# EAGLE design Easy_Check_rev2_chip_tray (EAGLE 9.4.0)
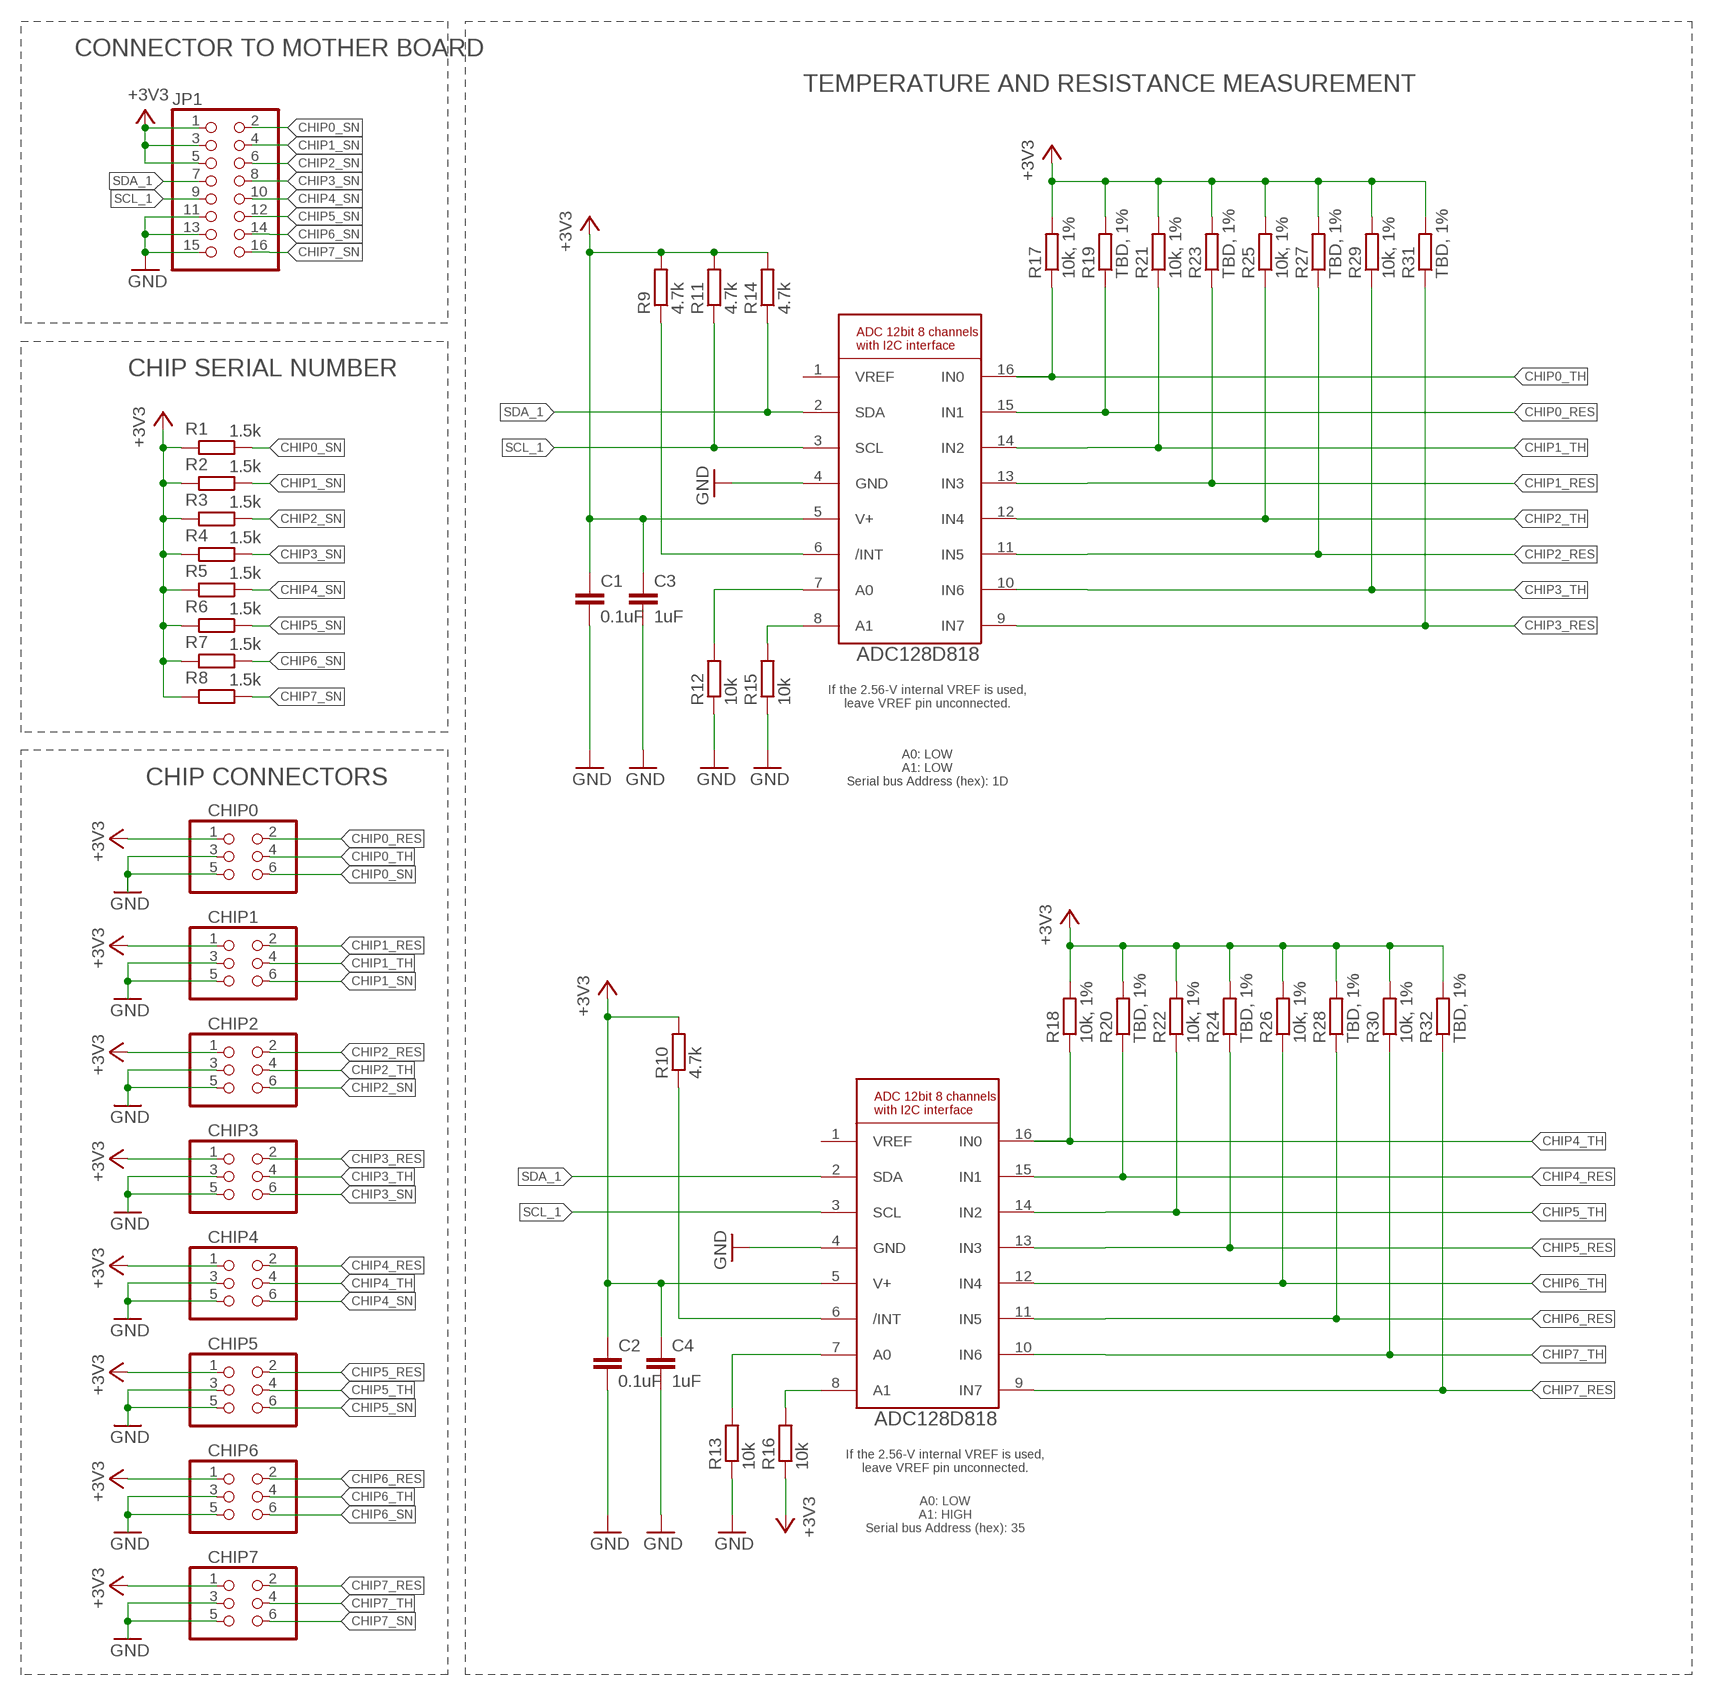
[diagram p0: schematic, sheet 1]

## Parts
C1  0.1uF  C-EUC0603  [C0603]
C2  0.1uF  C-EUC0603  [C0603]
C3  1uF  C-EUC0603  [C0603]
C4  1uF  C-EUC0603  [C0603]
CHIP0  PINHD-2X3  [2X03]
CHIP1  PINHD-2X3  [2X03]
CHIP2  PINHD-2X3  [2X03]
CHIP3  PINHD-2X3  [2X03]
CHIP4  PINHD-2X3  [2X03]
CHIP5  PINHD-2X3  [2X03]
CHIP6  PINHD-2X3  [2X03]
CHIP7  PINHD-2X3  [2X03]
JP1  PINHD-2X8  [2X08]
R1  1.5k  R-EU_R0603  [R0603]
R2  1.5k  R-EU_R0603  [R0603]
R3  1.5k  R-EU_R0603  [R0603]
R4  1.5k  R-EU_R0603  [R0603]
R5  1.5k  R-EU_R0603  [R0603]
R6  1.5k  R-EU_R0603  [R0603]
R7  1.5k  R-EU_R0603  [R0603]
R8  1.5k  R-EU_R0603  [R0603]
R9  4.7k  R-EU_R0603  [R0603]
R10  4.7k  R-EU_R0603  [R0603]
R11  4.7k  R-EU_R0603  [R0603]
R12  10k  R-EU_R0603  [R0603]
R13  10k  R-EU_R0603  [R0603]
R14  4.7k  R-EU_R0603  [R0603]
R15  10k  R-EU_R0603  [R0603]
R16  10k  R-EU_R0603  [R0603]
R17  10k, 1%  R-EU_R0603  [R0603]
R18  10k, 1%  R-EU_R0603  [R0603]
R19  TBD, 1%  R-EU_R0603  [R0603]
R20  TBD, 1%  R-EU_R0603  [R0603]
R21  10k, 1%  R-EU_R0603  [R0603]
R22  10k, 1%  R-EU_R0603  [R0603]
R23  TBD, 1%  R-EU_R0603  [R0603]
R24  TBD, 1%  R-EU_R0603  [R0603]
R25  10k, 1%  R-EU_R0603  [R0603]
R26  10k, 1%  R-EU_R0603  [R0603]
R27  TBD, 1%  R-EU_R0603  [R0603]
R28  TBD, 1%  R-EU_R0603  [R0603]
R29  10k, 1%  R-EU_R0603  [R0603]
R30  10k, 1%  R-EU_R0603  [R0603]
R31  TBD, 1%  R-EU_R0603  [R0603]
R32  TBD, 1%  R-EU_R0603  [R0603]
U1  LMD128D818  [ADC128D818]
U2  LMD128D818  [ADC128D818]

## Nets
+3V3: C1.1 C2.1 C3.1 C4.1 CHIP0.1 CHIP1.1 CHIP2.1 CHIP3.1 CHIP4.1 CHIP5.1 CHIP6.1 CHIP7.1 JP1.1 JP1.3 JP1.5 R1.2 R2.2 R3.2 R4.2 R5.2 R6.2 R7.2 R8.2 R9.2 R10.2 R11.2 R14.2 R16.1 R17.2 R18.2 R19.2 R20.2 R21.2 R22.2 R23.2 R24.2 R25.2 R26.2 R27.2 R28.2 R29.2 R30.2 R31.2 R32.2 U1.5(V+) U2.5(V+)
CHIP0_RES: CHIP0.2 R19.1 U1.15(IN1)
CHIP0_SN: CHIP0.6 JP1.2 R1.1
CHIP0_TH: CHIP0.4 R17.1 U1.16(IN0)
CHIP1_RES: CHIP1.2 R23.1 U1.13(IN3)
CHIP1_SN: CHIP1.6 JP1.4 R2.1
CHIP1_TH: CHIP1.4 R21.1 U1.14(IN2)
CHIP2_RES: CHIP2.2 R27.1 U1.11(IN5)
CHIP2_SN: CHIP2.6 JP1.6 R3.1
CHIP2_TH: CHIP2.4 R25.1 U1.12(IN4)
CHIP3_RES: CHIP3.2 R31.1 U1.9(IN7)
CHIP3_SN: CHIP3.6 JP1.8 R4.1
CHIP3_TH: CHIP3.4 R29.1 U1.10(IN6)
CHIP4_RES: CHIP4.2 R20.1 U2.15(IN1)
CHIP4_SN: CHIP4.6 JP1.10 R5.1
CHIP4_TH: CHIP4.4 R18.1 U2.16(IN0)
CHIP5_RES: CHIP5.2 R24.1 U2.13(IN3)
CHIP5_SN: CHIP5.6 JP1.12 R6.1
CHIP5_TH: CHIP5.4 R22.1 U2.14(IN2)
CHIP6_RES: CHIP6.2 R28.1 U2.11(IN5)
CHIP6_SN: CHIP6.6 JP1.14 R7.1
CHIP6_TH: CHIP6.4 R26.1 U2.12(IN4)
CHIP7_RES: CHIP7.2 R32.1 U2.9(IN7)
CHIP7_SN: CHIP7.6 JP1.16 R8.1
CHIP7_TH: CHIP7.4 R30.1 U2.10(IN6)
GND: C1.2 C2.2 C3.2 C4.2 CHIP0.3 CHIP0.5 CHIP1.3 CHIP1.5 CHIP2.3 CHIP2.5 CHIP3.3 CHIP3.5 CHIP4.3 CHIP4.5 CHIP5.3 CHIP5.5 CHIP6.3 CHIP6.5 CHIP7.3 CHIP7.5 JP1.11 JP1.13 JP1.15 R12.1 R13.1 R15.1 U1.4(GND) U2.4(GND)
N$1: R9.1 U1.6(/INT)
N$2: R10.1 U2.6(/INT)
N$3: R12.2 U1.7(A0)
N$4: R15.2 U1.8(A1)
N$5: R13.2 U2.7(A0)
N$6: R16.2 U2.8(A1)
SCL_1: JP1.9 R11.1 U1.3(SCL) U2.3(SCL)
SDA_1: JP1.7 R14.1 U1.2(SDA) U2.2(SDA)
Unconnected: U1.1(VREF) U2.1(VREF)

## Notes on the sheet
- CONNECTOR TO MOTHER BOARD
- TEMPERATURE AND RESISTANCE MEASUREMENT
- CHIP SERIAL NUMBER
- If the 2.56-V internal VREF is used,
  leave VREF pin unconnected.
- A0: LOW
  A1: LOW
  Serial bus Address (hex): 1D
- CHIP CONNECTORS
- If the 2.56-V internal VREF is used,
  leave VREF pin unconnected.
- A0: LOW
  A1: HIGH
  Serial bus Address (hex): 35

## Library data of the parts
C1-C4 = rcl:C-EU: CAPACITOR, European symbol; SPICEPREFIX: C
CHIP0 CHIP1-CHIP7 = pinhead:PINHD-2X3: PIN HEADER
JP1 = pinhead:PINHD-2X8: PIN HEADER
R1-R32 = rcl:R-EU_: RESISTOR, European symbol; SPICEPREFIX: R
U1 U2 = ADS128D818:LMD128D818: ADC 12-Bit, 8-Channel, ADC System Monitor with Temperature Sensor, Internal/External Reference, and I2C Interface http://www.ti.com/product/adc128d818 http://fr.farnell.com/texas-instruments/adc128d818cimt-nopb/adc-12-bits-10sps-i2c-tssop-16/dp/2395888

## Board
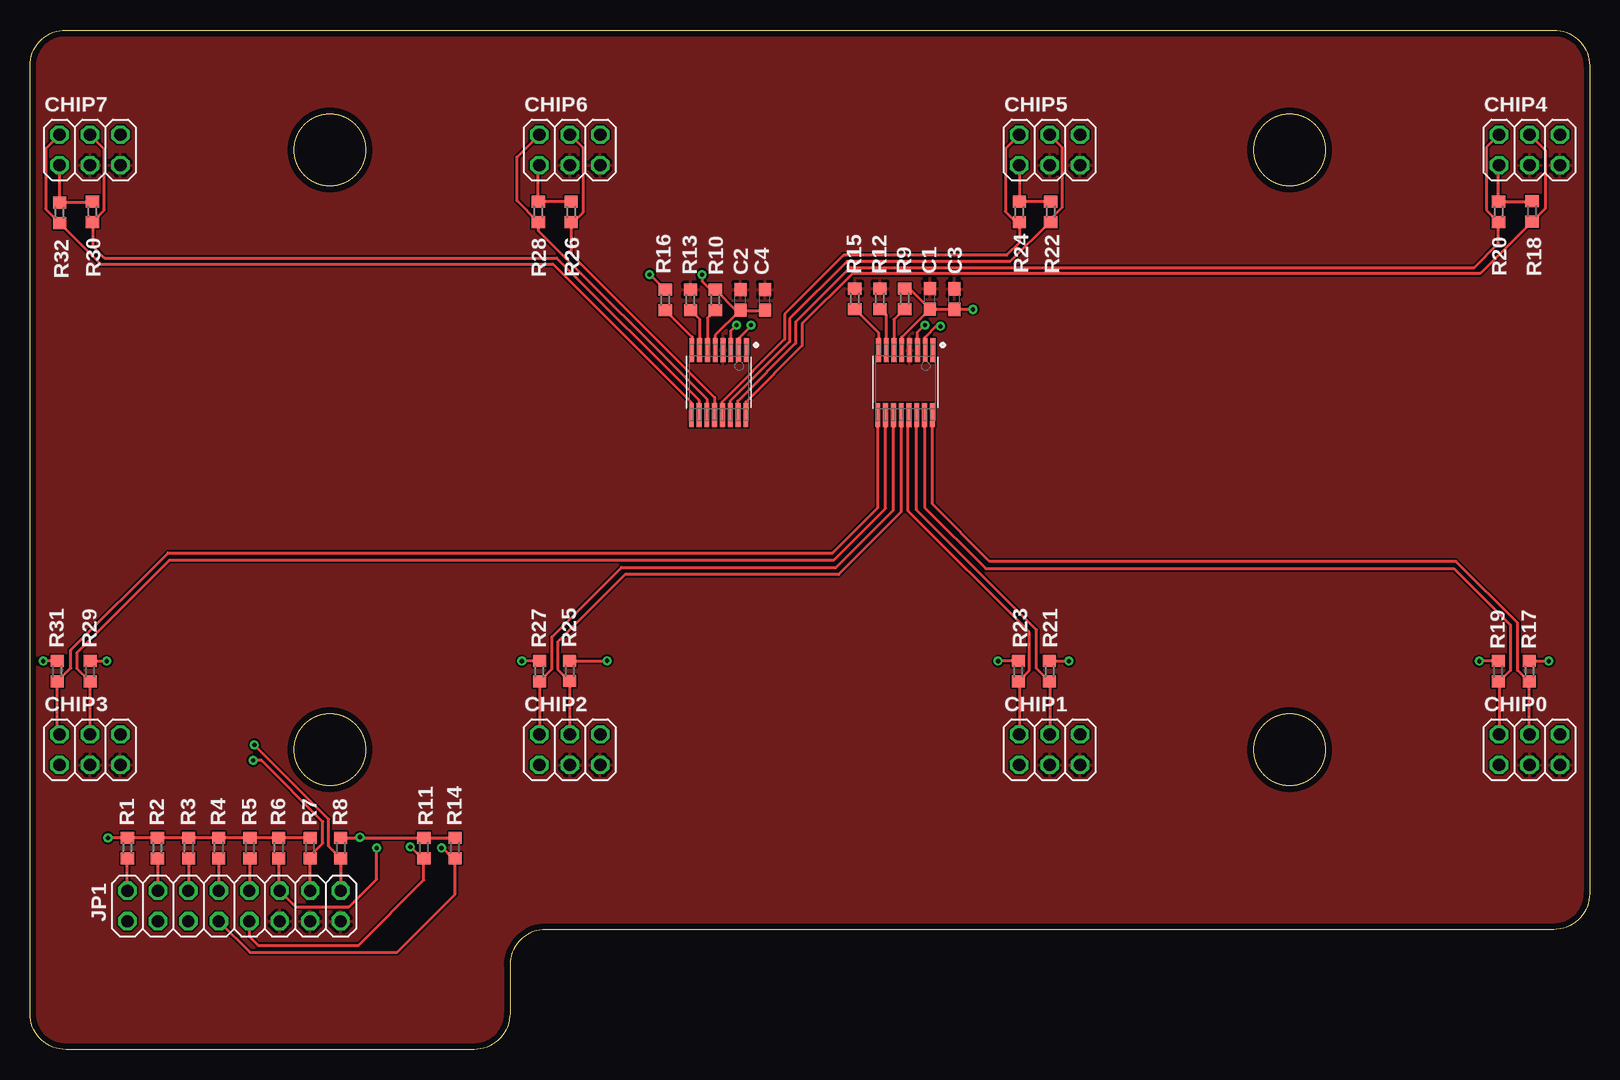
[diagram p1: board, top side]
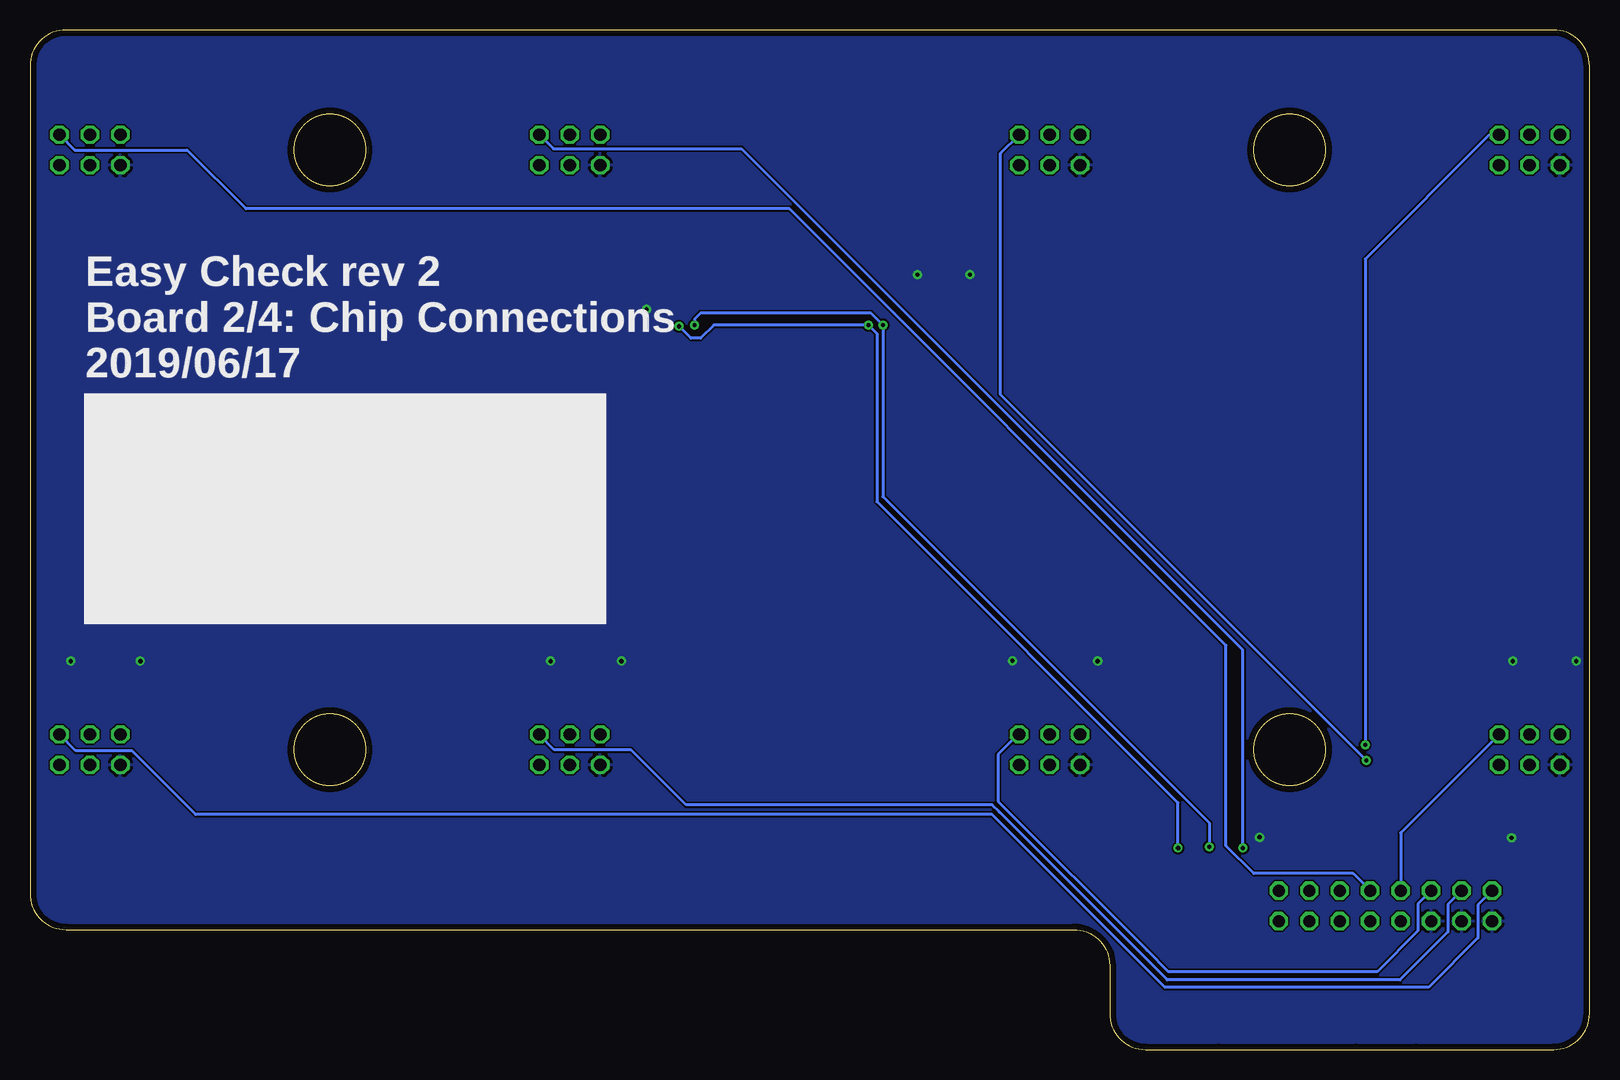
[diagram p2: board, bottom side, seen from below]

Size 130 x 85 mm. Coordinates in mm from the lower left corner, seen from the top.
Outline: 14.45,0 3,0
Outline: 30.9,0 19.45,0
Outline: 0,82 arc-90 3,85
Outline: 3,85 127,85
Outline: 127,85 arc-90 130,82
Outline: 130,82 130,13
Outline: 130,13 arc-90 127,10
Outline: 127,10 43,10
Outline: 43,10 arc90 40,7
Outline: 40,7 40,3
Outline: 40,3 arc-90 37,0
Outline: 37,0 3,0
Outline: 3,0 arc-90 0,3
Outline: 0,3 0,82
Outline: 0,82 arc-90 3,85
Outline: 3,85 127,85
Outline: 127,85 arc-90 130,82
Outline: 130,82 130,13
Outline: 130,13 arc-90 127,10
Outline: 127,10 43,10
Outline: 43,10 arc90 40,7
Outline: 40,7 40,3
Outline: 40,3 arc-90 37,0
Outline: 37,0 3,0
Outline: 3,0 arc-90 0,3
Outline: 0,3 0,82
Outline: circle at 25,25 radius 3
Outline: circle at 25,75 radius 3
Outline: circle at 105,75 radius 3
Outline: circle at 105,25 radius 3
Outline: circle at 25,25 radius 3
Outline: circle at 25,75 radius 3
Outline: circle at 105,75 radius 3
Outline: circle at 105,25 radius 3
Copper layers (1*16): Top 0.035mm / dielectric 1.5mm / Bottom 0.035mm
Design rules "default": minimum track width 6mil, minimum drill 0.35mm, track to track 6mil, track to pad 6mil, pad to pad 6mil, via to via 6mil, smd to smd 6mil, copper to edge 20mil, drill to drill 6mil, minimum pad ring 10mil, minimum via ring 8mil, stop-mask expansion 4mil, vias tented up to drill 0.4mm, thermal gap 10mil

### Footprints (pad centres in the part's own frame; a part is rotated, then mirrored left to right if it is on the bottom)
C0603 = smd 1.1 x 1: 1 -0.85,0; 2 0.85,0
2X03 = drill 1.016 octagon: 1 -2.54,-1.27; 2 -2.54,1.27; 3 0,-1.27; 4 0,1.27; 5 2.54,-1.27; 6 2.54,1.27
2X08 = drill 1.016 octagon: 1 -8.89,-1.27; 2 -8.89,1.27; 3 -6.35,-1.27; 4 -6.35,1.27; 5 -3.81,-1.27; 6 -3.81,1.27; 7 -1.27,-1.27; 8 -1.27,1.27; 9 1.27,-1.27; 10 1.27,1.27; 11 3.81,-1.27; 12 3.81,1.27; 13 6.35,-1.27; 14 6.35,1.27; 15 8.89,-1.27; 16 8.89,1.27
R0603 = smd 1 x 1.1: 1 -0.85,0; 2 0.85,0
ADC128D818 = smd 0.4 x 2: 1 -2.3,-2.7; 2 -1.65,-2.7; 3 -1,-2.7; 4 -0.35,-2.7; 5 0.3,-2.7; 6 0.95,-2.7; 7 1.6,-2.7; 8 2.25,-2.7; 9 2.3,2.75; 10 1.65,2.75; 11 1,2.75; 12 0.35,2.75; 13 -0.3,2.75; 14 -0.95,2.75; 15 -1.6,2.75; 16 -2.25,2.75

### Placement (x,y rotation side)
C1  75.01,62.59 90 top
C2  59.21,62.5 90 top
C3  77.05,62.56 90 top
C4  61.25,62.5 90 top
CHIP0  125,25 0 top
CHIP1  85,25 0 top
CHIP2  45,25 0 top
CHIP3  5,25 0 top
CHIP4  125,75 0 top
CHIP5  85,75 0 top
CHIP6  45,75 0 top
CHIP7  5,75 0 top
JP1  17.01,11.97 0 top
R1  8.13,16.8 90 top
R2  10.63,16.8 90 top
R3  13.23,16.8 90 top
R4  15.73,16.8 90 top
R5  18.33,16.8 90 top
R6  20.73,16.8 90 top
R7  23.35,16.8 90 top
R8  25.9,16.8 90 top
R9  72.91,62.6 90 top
R10  57.13,62.5 90 top
R11  32.83,16.8 90 top
R12  70.85,62.6 270 top
R13  55.05,62.5 270 top
R14  35.43,16.8 90 top
R15  68.75,62.6 270 top
R16  52.95,62.5 270 top
R17  124.99,31.53 90 top
R18  125.21,69.87 90 top
R19  122.39,31.53 90 top
R20  122.41,69.85 90 top
R21  84.99,31.53 90 top
R22  85.09,69.85 90 top
R23  82.39,31.53 90 top
R24  82.47,69.82 90 top
R25  44.99,31.56 90 top
R26  45.11,69.82 90 top
R27  42.47,31.53 90 top
R28  42.37,69.84 90 top
R29  5.01,31.53 90 top
R30  5.21,69.84 90 top
R31  2.27,31.53 90 top
R32  2.47,69.76 90 top
U1  72.97,55.63 180 top
U2  57.42,55.63 180 top

### Tracks (layer width: path | path; a pad name or v marks a point on that pad's centre or on a via)
+3V3  (via drill 0.35)
  Top 0.254: C2.1 59.13,61.57 | 59.13,61.57 57.12,59.56 U2.5 | C4.1 61.17,61.57 59.4,61.57 | 59.4,61.57 59.13,61.57 | 59.4,61.57 58.91,61.57 R10.2 56.73,63.35 56.03,64.05 v56.03,64.6 | U1.5 72.67,59.4 C1.1 | C1.1 77.02,61.74 C3.1 v78.6,61.71 | C1.1 73.3,63.45 R9.2 | R30.2 5.21,70.61 R32.2 CHIP7.1 | R26.2 42.37,70.67 R28.2 42.37,73.73 CHIP6.1 | CHIP5.1 R24.2 85.3,70.67 85.12,70.67 R22.2 | R18.2 125.21,70.7 R20.2 122.41,73.73 CHIP4.1 | R16.1 51.7,64.6 v51.65,64.6 | R7.2 R6.2 R5.2 R4.2 R3.2 R2.2 R1.2 v6.5,17.65 | R8.2 27.5,17.65 | 27.5,17.65 R11.2 R14.2 | 27.5,17.65 v27.5,17.7 | R23.2 v80.7,32.38 | R21.2 v86.6,32.38 | R19.2 v120.8,32.38 | R17.2 v126.6,32.38 | R31.2 v1.1,32.38 | R29.2 v6.4,32.38 | R27.2 v41,32.38 | R25.2 v48.1,32.41
  pour Bottom: -1.2,87.2 134.5,87.2 134.5,-1.6 -1.2,-1.6
CHIP0_RES
  Top 0.254: U1.15 74.57,45.2 79.67,40.1 118.7,40.1 123.4,35.4 123.4,31.6 122.48,30.68 R19.1 122.46,30.61 CHIP0.2
CHIP0_SN
  Top 0.254: JP1.2 R1.1
  Bottom 0.254: JP1.2 9.3,12.06 9.3,9.3 13.4,5.2 35.4,5.2 49.79,19.59 116.19,19.59 121.5,24.9 126.17,24.9 CHIP0.6
CHIP0_TH
  Top 0.254: CHIP0.4 R17.1 124.92,30.68 124.01,31.59 124.01,35.57 118.87,40.71 79.99,40.71 75.22,45.48 U1.16
CHIP1_RES
  Top 0.254: CHIP1.2 82.46,30.61 R23.1 83.3,31.59 83.3,34.8 73.2,44.9 73.2,52.81 U1.13
CHIP1_SN
  Top 0.254: R2.1 10.66,15.92 JP1.4
  Bottom 0.254: JP1.4 11.8,12.1 11.8,9.8 15.8,5.8 35.2,5.8 49.2,19.8 49.8,20.4 75.3,20.4 79.9,25 86.3,25 87.54,26.24 CHIP1.6
CHIP1_TH
  Top 0.254: CHIP1.4 R21.1 83.9,31.77 83.9,35 73.9,45 73.9,52.86 U1.14
CHIP2_RES
  Top 0.254: CHIP2.2 R27.1 43.5,31.71 43.5,34.4 49.3,40.2 67.2,40.2 71.97,44.97 U1.11
CHIP2_SN
  Top 0.254: R3.1 13.23,13.27 JP1.6
  Bottom 0.254: CHIP2.6 47.63,26.27 49.3,24.6 49.3,20.7 36.9,8.3 35.1,6.5 17.7,6.5 14.3,9.9 14.3,12.14 JP1.6
CHIP2_TH
  Top 0.254: R25.1 | R25.1 CHIP2.4 | R25.1 43.99,31.7 43.99,33.99 49.6,39.6 67.4,39.6 72.62,44.82 U1.12
CHIP3_RES
  Top 0.254: CHIP3.2 2.27,26.46 R31.1 3.4,31.81 3.4,33.3 11.5,41.4 66.9,41.4 70.67,45.17 U1.9
CHIP3_SN
  Top 0.254: R4.1 JP1.8
  Bottom 0.254: CHIP3.6 15.74,18.07 JP1.8
CHIP3_TH
  Top 0.254: CHIP3.4 R29.1 3.91,31.78 3.91,33.08 11.63,40.8 67,40.8 71.32,45.12 U1.10
CHIP4_RES
  Top 0.254: U2.15 59.02,54.08 63.82,58.88 63.82,60.66 68.36,65.2 120.4,65.2 122.41,67.21 R20.1 121.4,70 121.4,75.21 CHIP4.2
CHIP4_SN
  Top 0.254: R5.1 18.33,13.29 JP1.10
  Bottom 0.254: JP1.10 18.28,13.27 19.69,14.68 27.98,14.68 30.3,17 30.3,33.7 66.7,70.1 112,70.1 116.9,75 126.27,75 CHIP4.6
CHIP4_TH
  Top 0.254: R18.1 125.14,68.95 | 125.14,68.95 120.89,64.7 68.56,64.7 64.37,60.52 64.37,58.68 59.67,53.98 U2.16 | CHIP4.4 126.3,74.97 126.3,70.11 125.14,68.95
CHIP5_RES
  Top 0.254: R24.1 82.47,68.7 | 82.47,68.7 82.47,67.27 81.41,66.21 67.82,66.21 62.91,61.3 62.91,59.21 57.69,54 57.69,52.91 U2.13 | CHIP5.2 81.3,75.11 81.3,69.87 82.47,68.7
CHIP5_SN  (via drill 0.35)
  Top 0.254: R6.1 20.73,13.33 JP1.12 22.16,11.9 26.6,11.9 28.9,14.2 v28.9,16.8
  Bottom 0.254: v28.9,16.8 28.9,33.3 70.7,75.1 86.37,75.1 CHIP5.6
CHIP5_TH
  Top 0.254: U2.14 58.37,54.07 63.31,59.01 63.31,60.93 68.09,65.71 81.71,65.71 85,69 R22.1 85.09,69.25 86.04,70.21 86.04,75.23 CHIP5.4
CHIP6_RES
  Top 0.254: U2.11 56.42,54.24 42.37,68.29 R28.1 40.6,70.76 40.6,74.41 CHIP6.2
CHIP6_SN  (via drill 0.35)
  Top 0.254: JP1.14 R7.1 23.35,16.15 24.4,17.2 24.4,19 19.3,24.1 v18.6,24.1
  Bottom 0.254: v18.6,24.1 49.1,54.6 49.1,74.71 CHIP6.6
CHIP6_TH
  Top 0.254: R26.1 45.11,68.8 | 45.11,68.8 45.11,66.33 57.07,54.37 U2.12 | CHIP6.4 46.1,75.17 46.1,69.79 45.11,68.8
CHIP7_RES
  Top 0.254: R32.1 2.69,68.69 | 2.69,68.69 5.89,65.49 43.6,65.49 55.12,53.97 U2.9 | CHIP7.2 1.3,75.11 1.3,70.08 2.69,68.69
CHIP7_SN  (via drill 0.35)
  Top 0.254: JP1.16 R8.1 24.9,16.95 24.9,19.2 v18.7,25.4
  Bottom 0.254: v18.7,25.4 18.7,65.91 8.34,76.27 CHIP7.6
CHIP7_TH
  Top 0.254: U2.10 55.77,54.13 43.9,66 6.2,66 5.21,66.99 R30.1 6.2,69.98 6.2,75.07 CHIP7.4
GND
  pour Top: -1.6,87.9 -1.6,-2.2 138.4,-2.2 138.4,87.9
N$1
  Top 0.254: R9.1 72.02,60.86 U1.6
N$2
  Top 0.254: R10.1 56.47,60.99 U2.6
N$3
  Top 0.254: R12.2 71.37,61.23 U1.7
N$4
  Top 0.254: R15.2 70.72,59.78 U1.8
N$5
  Top 0.254: R13.2 55.82,60.88 U2.7
N$6
  Top 0.254: R16.2 55.2,59.4 55.2,58.36 U2.8
SCL_1  (via drill 0.35)
  Top 0.254: U1.3 73.97,59.8 74.57,60.4 v74.6,60.4 | U2.3 58.42,59.92 v58.9,60.4 | JP1.9 18.28,9.42 19,8.7 27.4,8.7 32.83,14.13 32.83,15.8 | 32.83,15.8 R11.1 | v31.7,16.9 31.73,16.9 32.83,15.8
  Bottom 0.254: v31.7,16.9 31.7,18.9 45.1,32.3 58.9,46.1 v58.9,60.4 59.9,61.4 74.1,61.4 74.6,60.9 v74.6,60.4
SDA_1  (via drill 0.35)
  Top 0.254: U1.2 74.59,58.36 74.59,59.36 75.53,60.3 v75.9,60.3 | U2.2 59.04,58.36 59.04,59.25 60.1,60.3 v60.1,60.4 | JP1.7 18.34,8.1 30.6,8.1 35.43,12.93 R14.1 35.23,15.95 34.38,16.8 v34.3,16.8
  Bottom 0.254: v34.3,16.8 34.3,20.58 59.4,45.68 59.4,59.7 v60.1,60.4 73,60.4 74.1,59.3 74.9,59.3 v75.9,60.3

### Text on the board
bPlace: Easy Check rev 2 / Board 2/4: Chip Connections / 2019/06/17